# EAGLE design controller12lcd (EAGLE 8.3.1)

## Sheet 1 of 2
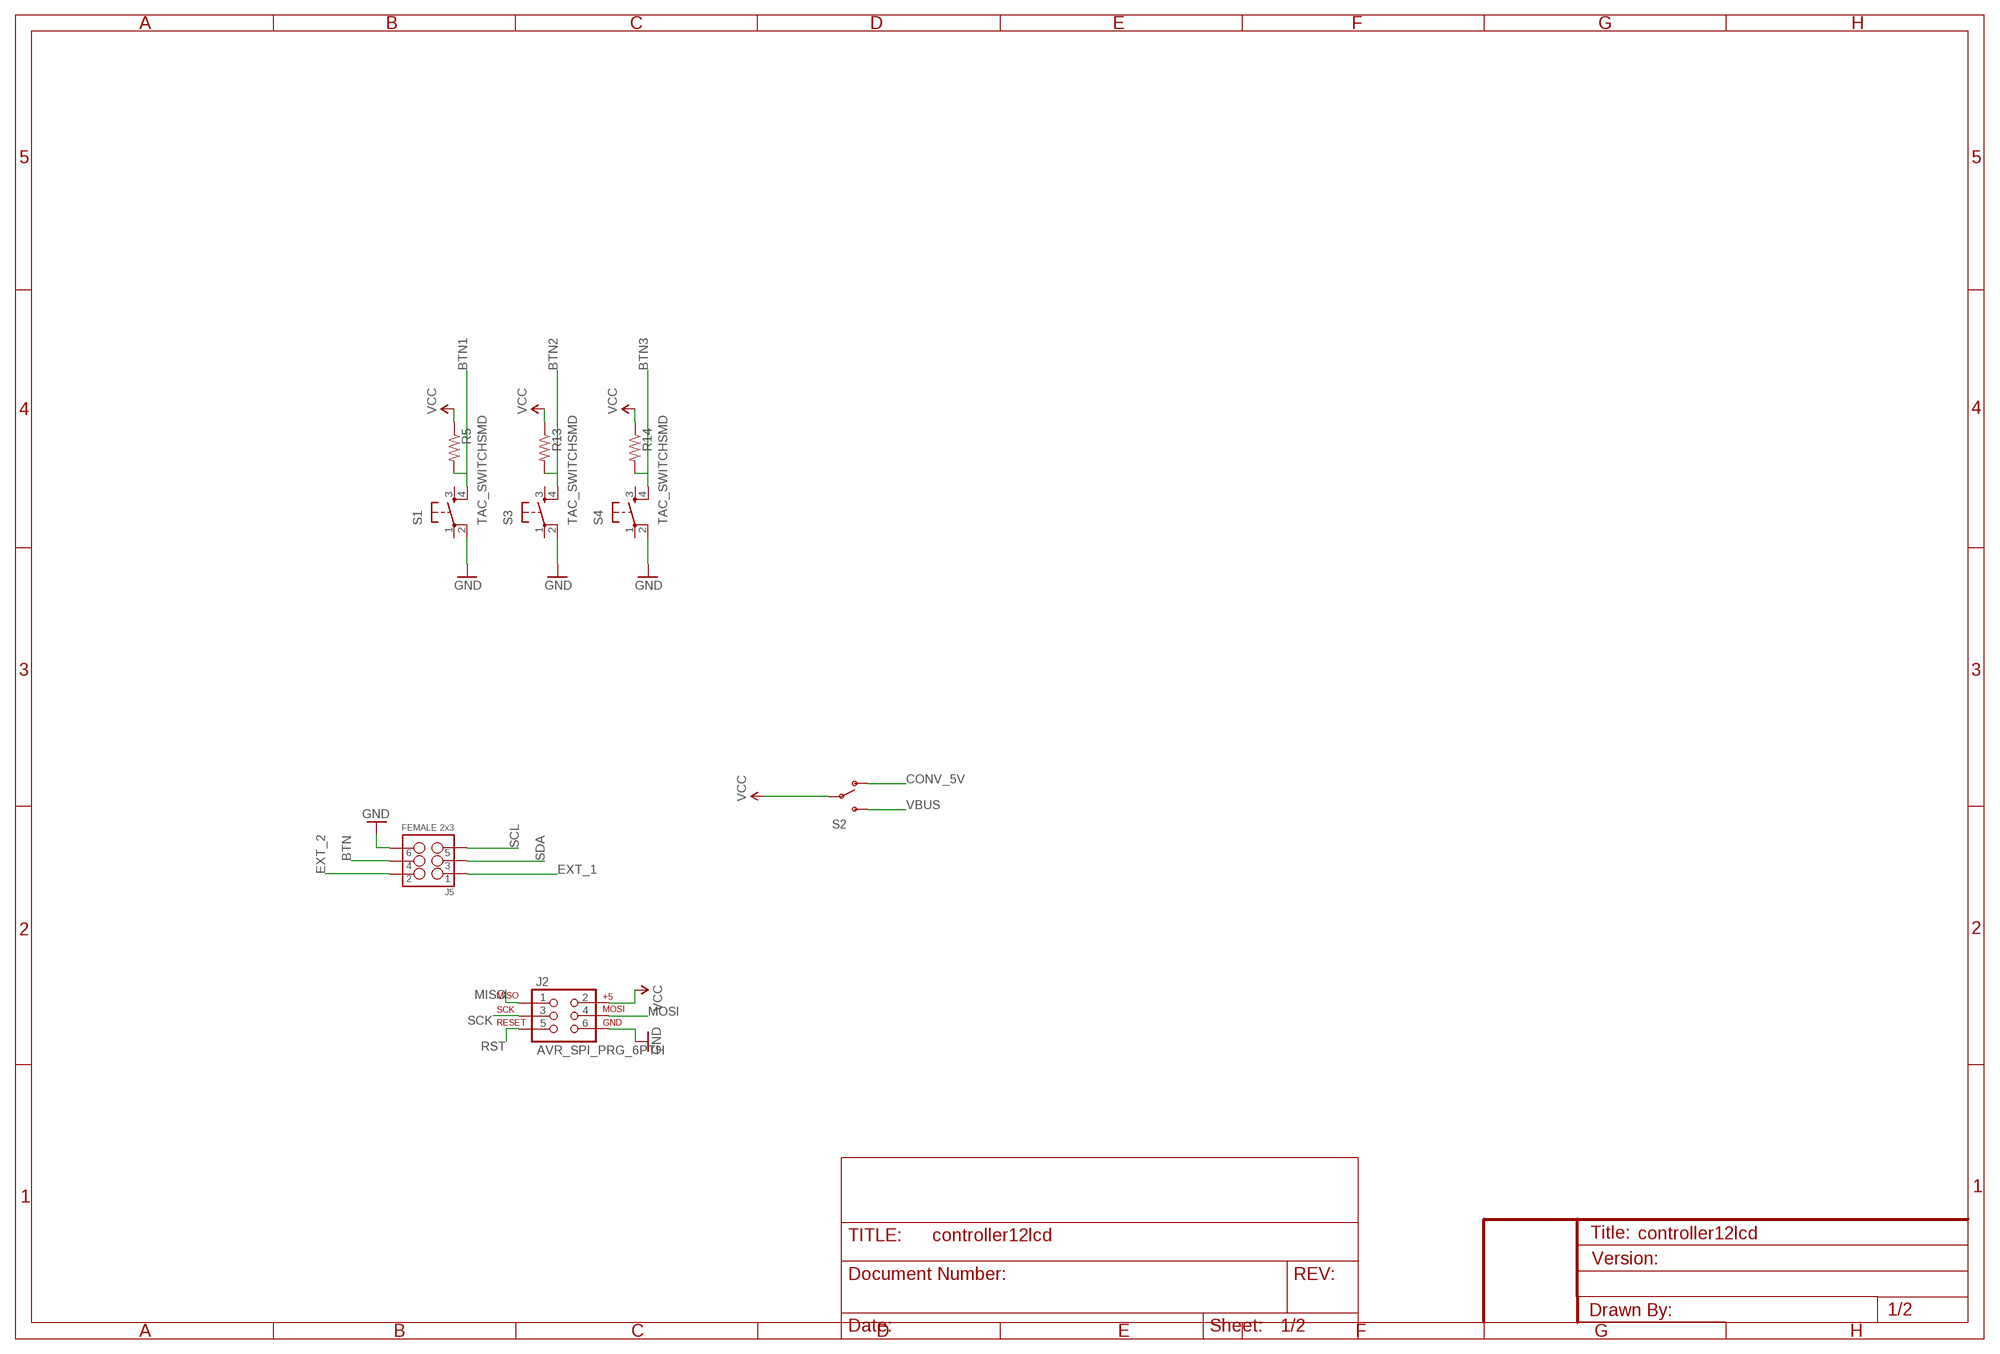
[diagram p0: schematic, sheet 1]

### Parts
J2  AVR_SPI_PRG_6PTH  [2X3]
J5  FEMALE 2x3  M03X2FEMALE  [2X3]
R5  RESISTOR1206  [1206]
R13  RESISTOR1206  [1206]
R14  RESISTOR1206  [1206]
S1  TAC_SWITCHSMD  TAC_SWITCHPTH  [TACTILE-PTH]
S2  SWITCH-SPDTSMD2  [SWITCH-SPDT-SMD]
S3  TAC_SWITCHSMD  TAC_SWITCHPTH  [TACTILE-PTH]
S4  TAC_SWITCHSMD  TAC_SWITCHPTH  [TACTILE-PTH]

### Nets
BTN: J5.4
BTN1: R5.2 S1.4
BTN2: R13.2 S3.4
BTN3: R14.2 S4.4
CONV_5V [power]: S2.1(O)
EXT_1: J5.1
EXT_2: J5.2
GND: J2.6 J5.6 S1.2 S3.2 S4.2 ; also sheet 2
MISO: J2.1
MOSI: J2.4
RST: J2.5
SCK: J2.3
SCL: J5.5
SDA: J5.3
VBUS: S2.3(S)
VCC [power]: J2.2 R5.1 R13.1 R14.1 S2.2(P) ; also sheet 2
Unconnected: S1.1 S1.3 S3.1 S3.3 S4.1 S4.3

## Sheet 2 of 2
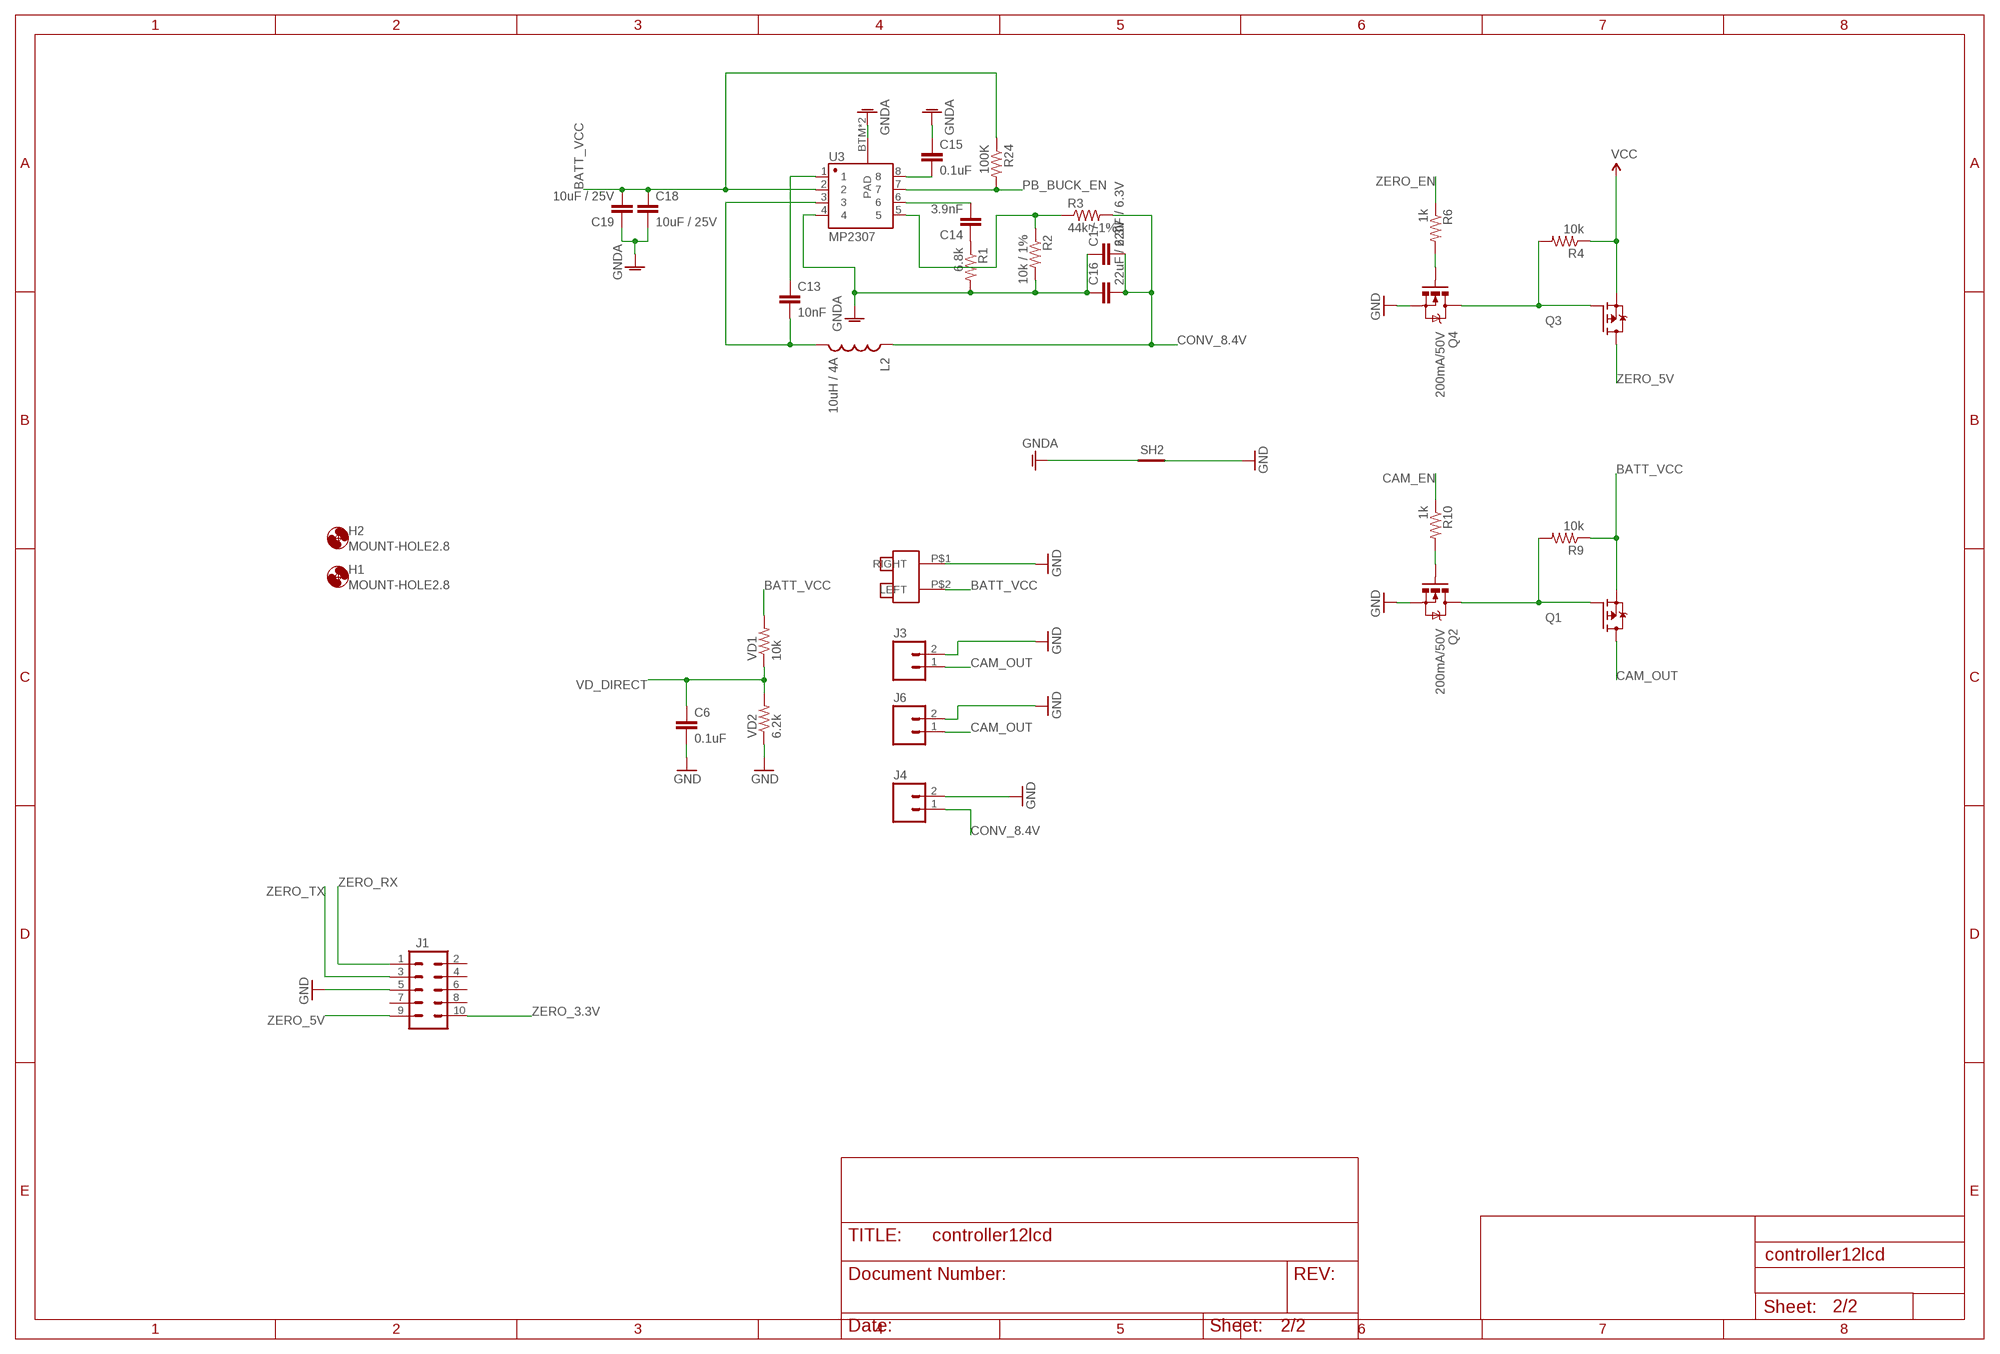
[diagram p1: schematic, sheet 2]

### Parts
C6  0.1uF  CAP1206  [1206]
C13  10nF  CAP1206  [1206]
C14  3.9nF  CAP1206  [1206]
C15  0.1uF  CAP1206  [1206]
C16  22uF / 6.3V  CAP1210  [1210]
C17  22uF / 6.3V  CAP1210  [1210]
C18  10uF / 25V  CAP1210  [1210]
C19  10uF / 25V  CAP1210  [1210]
H1  MOUNT-HOLE2.8  [2,8]
H2  MOUNT-HOLE2.8  [2,8]
J1  M05X2PTH  [AVR_ICSP]
J3  M023.5MM_LOCK  [SCREWTERMINAL-3.5MM-2_LOCK]
J4  M02PTH  [1X02]
J6  M023.5MM_LOCK  [SCREWTERMINAL-3.5MM-2_LOCK]
L2  10uH / 4A  INDUCTORSRU1038  [SRU1038]
Q1  FDD4141TO252  [TO252]
Q2  200mA/50V  MOSFET-NCHANNELBSS138  [SOT23-3]
Q3  FDD4141TO252  [TO252]
Q4  200mA/50V  MOSFET-NCHANNELBSS138  [SOT23-3]
R1  6.8k  RESISTOR1206  [1206]
R2  10k / 1%  RESISTOR1206  [1206]
R3  44k / 1%  RESISTOR1206  [1206]
R4  10k  RESISTOR1206  [1206]
R6  1k  RESISTOR1206  [1206]
R9  10k  RESISTOR1206  [1206]
R10  1k  RESISTOR1206  [1206]
R24  100K  RESISTOR1206  [1206]
SH2  SHORT-HT5  [SHORT_TOP-50]
U3  MP2307  GENERIC-SOIC8MSGEQ7N-FILTER  [SO08]
U$4  NANOFIT2  [NANOFIT2]
VD1  10k  RESISTOR1206  [1206]
VD2  6.2k  RESISTOR1206  [1206]

### Nets
BATT_VCC [camera_power]: C18.1 C19.2 Q1.2(S) R9.1 R24.1 U3.2 U$4.P$2(LEFT) VD1.2
CAM_EN: R10.1
CAM_OUT [camera_power]: J3.1 J6.1 Q1.3(D)
CONV_8.4V [power]: C16.2 C17.2 J4.1 L2.1 R3.2
GND: C6.2 J1.5 J3.2 J4.2 J6.2 Q2.2(S) Q4.2(S) SH2.2 U$4.P$1(RIGHT) VD2.1 ; also sheet 1
GNDA [power]: C15.1 C16.1 C17.1 C18.2 C19.1 R1.2 R2.2 SH2.1 U3.4 U3.BTM(PAD) U3.P$1(PAD)
N$1: Q1.1(G) Q2.3(D) R9.2
N$2: Q4.1(G) R6.2
N$3: Q3.1(G) Q4.3(D) R4.2
N$6: Q2.1(G) R10.2
N$25: C15.2 U3.8
N$26 [power]: C13.2 L2.2 U3.3
N$27: C13.1 U3.1
N$28: C14.1 R1.1
N$29: C14.2 U3.6
N$30: R2.1 R3.1 U3.5
PB_BUCK_EN: R24.2 U3.7
VCC [power]: Q3.2(S) R4.1 ; also sheet 1
VD_DIRECT: C6.1 VD1.1 VD2.2
ZERO_3.3V: J1.10
ZERO_5V [power]: J1.9 Q3.3(D)
ZERO_EN: R6.1
ZERO_RX: J1.1
ZERO_TX: J1.3
Unconnected: J1.2 J1.4 J1.6 J1.7 J1.8

## Library data of the parts
C6 C13-C19 = SparkFun-Capacitors:CAP: Capacitor Standard 0603 ceramic capacitor, and 0.1" leaded capacitor.
H1 H2 = holes:MOUNT-HOLE: MOUNTING HOLE with drill center marker
J1 = SparkFun-Connectors:M05X2: Header 5x2 Standard 10-pin dual row 0.1" header. Commonly used with AVR-ISP. Use with Spark Fun Electronics SKU: PRT-00778
J2 = SparkFun-Connectors:AVR_SPI_PRG_6: AVR ISP 6 Pin This is the reduced ISP connector for AVR programming. Common on Arduino. This footprint will take up less PCB space and can be used with a 10-pin to 6-pin adapter such as SKU: BOB-08508 **Special note about "TEST_POINT" package. The stop mask is on the top side, so if you want your programming test points to be on the bottom of your board, make sure to place this package on the bottom side of the board. This also ensure that the orientation to program from the bottom side will be correct.
J3 J6 = SparkFun-Connectors:M02: Standard 2-pin 0.1" header. Use with - straight break away headers ( PRT-00116) - right angle break away headers (PRT-00553) - swiss pins (PRT-00743) - machine pins (PRT-00117) - female headers (PRT-00115) Molex polarized connector foot print use with: PRT-08233 with associated crimp pins and housings. 2.54_SCREWTERM for use with PRT-10571. 3.5mm Screw Terminal footprints for PRT-08084 5mm Screw Terminal footprints for use with PRT-08432; PROD_ID: CONN-08399
J4 = SparkFun-Connectors:M02: Standard 2-pin 0.1" header. Use with - straight break away headers ( PRT-00116) - right angle break away headers (PRT-00553) - swiss pins (PRT-00743) - machine pins (PRT-00117) - female headers (PRT-00115) Molex polarized connector foot print use with: PRT-08233 with associated crimp pins and housings. 2.54_SCREWTERM for use with PRT-10571. 3.5mm Screw Terminal footprints for PRT-08084 5mm Screw Terminal footprints for use with PRT-08432
J5 = SparkFun-Connectors:M03X2: 2x3 .1" header. Shrouded, with keying- CONN-10681 SMT- CONN-11415 Pogo pins- HW-11044; PROD_ID: CONN-11566
L2 = SparkFun-Passives:INDUCTOR: Inductors Basic Inductor/Choke - 0603 and 1206. Footprints are not proven and vary greatly between part numbers. INDUCTOR POWER 3.3UH 4.0A SMD 0.197" L x 0.197" W x 0.177" H (5.00mm x 5.00mm x 4.50mm)
Q1 Q3 = transistor-fet:FDD4141: P-Channel PowerTrench® MOSFET Source: FDD4141.pdf
Q2 Q4 = SparkFun-DiscreteSemi:MOSFET-NCHANNEL: Common NMOSFET Parts MFG P/N Store ID Prod ID FDD8780 TRANS-09984 SI7820DN TRANS-11055 FDS6630A IC-08089 2N7002PW TRANS-11151 FQP30N06L COM-10213 TRANS-10060 BSS123LT1G TRANS-08345 BSS138 TRANS-00830 BS170 2N7000; PROD_ID: TRANS-00830
R1-R4 R6 R9 R10 R24 = SparkFun-Resistors:RESISTOR: Resistor Basic schematic elements and footprints for 0603, 1206, and PTH resistors.
R5 R13 R14 VD1 VD2 = SparkFun-Passives:RESISTOR: Resistor Basic schematic elements and footprints for 0603, 1206, and PTH resistors.
S1 S3 S4 = SparkFun-Retired:TAC_SWITCH: Momentary Switch Button commonly used for reset or general input. Spark Fun Electronics SKU : COM-00097 SMT- SWCH-08247
S2 = SparkFun-Electromechanical:SWITCH-SPDT: SPDT Switch Simple slide switch, Spark Fun Electronics SKU : COM-00102 DPDT SMT slide switch, AYZ0202, SWCH-08179
SH2 = shorts:SHORT-H: Short between two nets; BOM: no
U3 = SparkFun-AnalogIC:GENERIC-SOIC8: A placeholder for generic narrow & wide SOIC8 foorptints - used on the DIP adapter board.; PROD_ID: IC-10141
U$4 = volzolib:NANOFIT2

## Net classes
0 default: width 0.254 mm, clearance 0.254 mm
1 power: width 0.381 mm, clearance 0.254 mm
2 camera_power: width 0.66 mm, clearance 0.254 mm
3 usbsignal: width 0.254 mm, clearance 0.203 mm

## Board
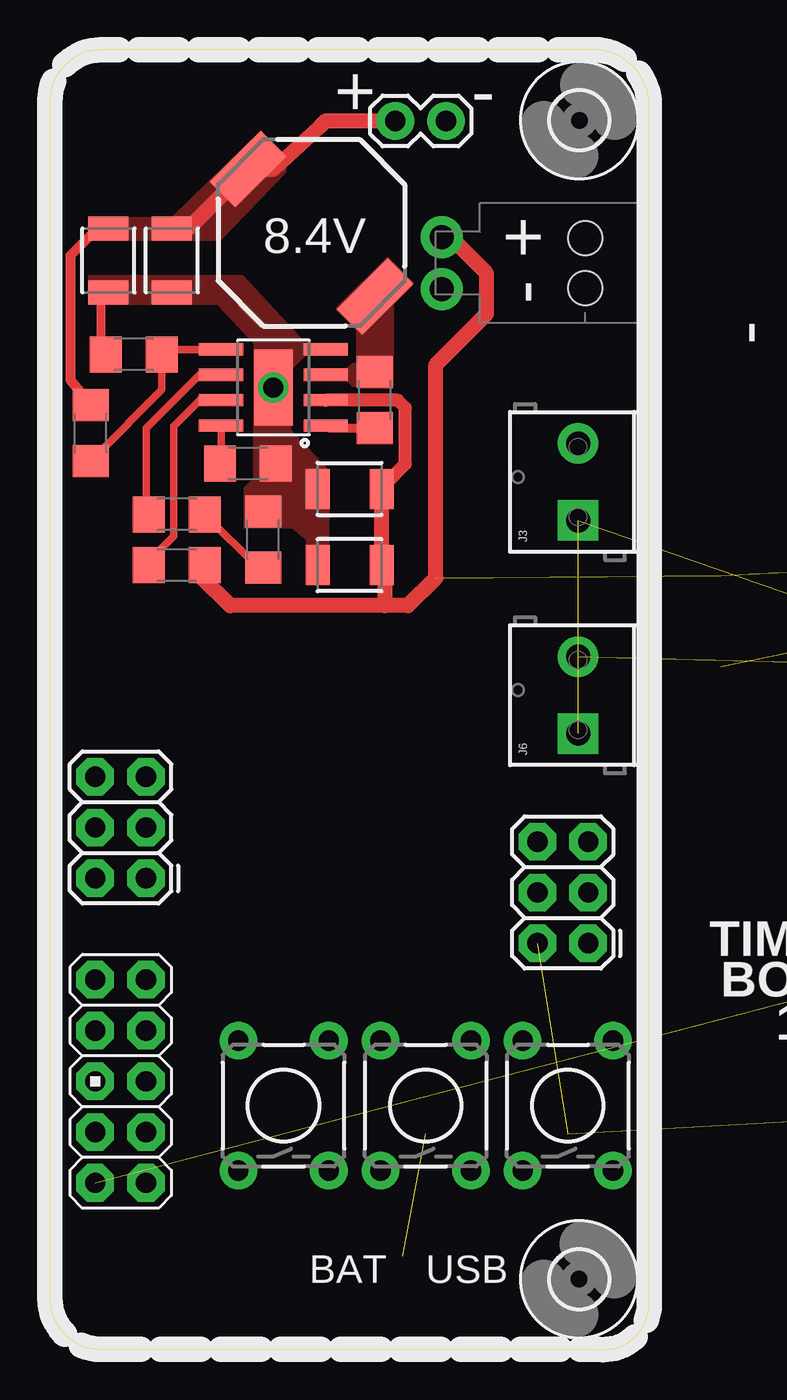
[diagram p2: board, top side]
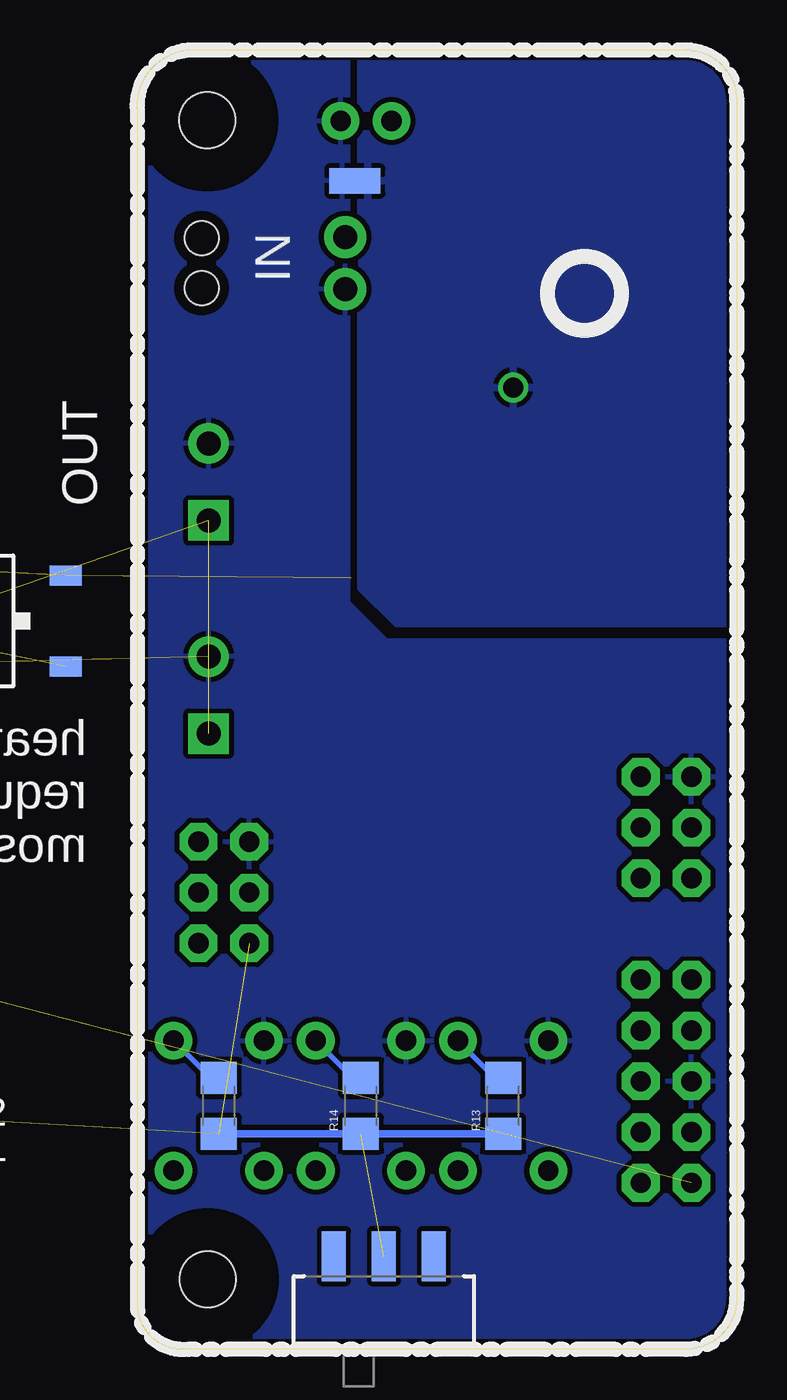
[diagram p3: board, bottom side, seen from below]

Size 29.98 x 65.04 mm. Coordinates in mm from the lower left corner, seen from the top.
Outline: 0,2.55 arc90 2.54,0.01 27.43,0.01 arc90 29.97,2.05 29.97,61.99 arc90 27.43,65.04 2.54,65.04 arc90 0,62.5 0,2.55
Copper layers (1*16): Top 0.035mm / dielectric 1.5mm / Bottom 0.035mm
Design rules "default *": minimum track width 10mil, minimum drill 24mil, track to track 8mil, track to pad 8mil, pad to pad 8mil, via to via 8mil, smd to smd 8mil, copper to edge 20mil, drill to drill 8mil, minimum pad ring 10mil, minimum via ring 8mil, stop-mask expansion 4mil, vias tented up to drill 0mil, thermal gap 10mil

### Footprints (pad centres in the part's own frame; a part is rotated, then mirrored left to right if it is on the bottom)
1206 = smd 1.6 x 1.8: 1 -1.4,0; 2 1.4,0
1210 = smd 1.2 x 2: 1 -1.6,0; 2 1.6,0
2,8 = hole 2.8: 0,0
AVR_ICSP = drill 1.016 pad 1.88 octagon: 1 -1.27,5.08; 2 1.27,5.08; 3 -1.27,2.54; 4 1.27,2.54; 5 -1.27,0; 6 1.27,0; 7 -1.27,-2.54; 8 1.27,-2.54; 9 -1.27,-5.08; 10 1.27,-5.08
2X3 = drill 1.016 pad 1.88 octagon: 1 0,0; 2 0,2.54; 3 2.54,0; 4 2.54,2.54; 5 5.08,0; 6 5.08,2.54
SCREWTERMINAL-3.5MM-2_LOCK = drill 1.2 pad 2.032 square: 1 -0.178,0 | drill 1.2 pad 2.032: 2 3.678,0
1X02 = drill 1.016 pad 1.88: 1 0,0; 2 2.54,0
SRU1038 = smd 1.8 x 3.6: 1 -4.5,0; 2 4.5,0
TO252 = smd 1 x 1.6: 1 -2.28,-4.8; 2 2.28,-4.8 | smd 5.4 x 6.2: 3 0,2.5
SOT23-3 = smd 0.8 x 0.9: 1 -0.95,-1; 2 0.95,-1; 3 0,1.1
TACTILE-PTH = drill 1.016 pad 1.88: 1 -3.251,2.261; 2 3.251,2.261; 3 -3.251,-2.261; 4 3.251,-2.261
SWITCH-SPDT-SMD = smd 1.2 x 2.5: 1 -2.5,-2.75; 2 0,-2.75; 3 2.5,-2.75
SHORT_TOP-50 = smd 1.27 x 1.27: 1 0.635,0; 2 -0.635,0
SO08 = smd 0.61 x 2.21: 1 -1.905,-2.616; 2 -0.635,-2.616; 3 0.635,-2.616; 4 1.905,-2.616; 5 1.905,2.616; 6 0.635,2.616; 7 -0.635,2.616; 8 -1.905,2.616 | smd 3.81 x 1.93: BTM 0,0 | drill 1: P$1 0,0
NANOFIT2 = drill 1.2 pad 2.1: P$1 10.38,1.3; P$2 10.38,-1.3 | hole 1.7: 3.2,1.25; 3.2,-1.25

### Placement (x,y rotation side)
C6  52.2,34.05 0 bottom  (outside the outline)
C13  16.26,47.51 90 top
C14  6.35,41.8 180 top
C15  9.91,44.34 180 top
C16  2.92,54.5 90 top
C17  6.1,54.5 90 top
C18  14.99,39.26 180 top
C19  14.99,43.07 0 top
H1  26.47,3.52 0 top
H2  26.48,61.52 0 top
J1  3.53,13.42 0 top
J2  26.92,20.33 90 top
J3  26.42,41.67 90 top
J4  17.27,61.48 0 top
J5  4.8,23.58 90 top
J6  26.42,31 90 top
L2  13.08,55.89 315 top
Q1  38.35,36.46 90 bottom  (outside the outline)
Q2  54.99,48.15 270 top  (outside the outline)
Q3  53.98,21.22 270 bottom  (outside the outline)
Q4  58.29,14.36 180 top  (outside the outline)
R1  10.67,40.53 90 top
R2  4.19,49.8 180 top
R3  2.03,45.86 90 top
R4  48.77,10.68 270 top  (outside the outline)
R5  25.91,12.21 90 bottom
R6  50.8,14.75 180 top  (outside the outline)
R9  59.44,40.91 270 bottom  (outside the outline)
R10  60.07,47.38 90 top  (outside the outline)
R13  11.68,12.21 90 bottom
R14  18.8,12.21 90 bottom
R24  6.35,39.26 180 top
S1  25.91,12.21 90 top
S2  17.65,1.92 180 bottom
S3  11.68,12.21 90 top
S4  18.8,12.21 90 top
SH2  19.1,58.48 0 bottom
U3  11.18,48.15 90 top
U$4  29.97,54.37 180 top
VD1  52.2,39.64 0 bottom  (outside the outline)
VD2  52.2,36.84 180 bottom  (outside the outline)

### Tracks (layer width: path | path; a pad name or v marks a point on that pad's centre or on a via)
BATT_VCC  (3 unrouted)
  Top 0.66: 16.51,43.07 C19.2 16.76,43.32 17.78,44.34 17.78,47.13 17.4,47.51 U3.2 | 16.51,39.26 C18.1
  Top 0.762: 16.59,39.33 C19.2 | 16.59,39.33 16.51,39.26 | C18.1 16.39,39.26 | 16.51,38.75 16.59,38.82 16.59,39.33 | 16.76,37.22 17.91,37.22 19.3,38.62 19.3,49.29 21.84,51.83 21.84,53.86 20.32,55.39 19.88,55.39 U$4.P$2 | 16.76,37.22 9.02,37.22 7.62,38.62 7.62,39.13 R24.1 | 16.76,37.22 16.76,39.15 16.59,39.33
BTN1
  Bottom 0.254: R5.2 26.32,13.61 S1.4
BTN2
  Bottom 0.254: R13.2 12.09,13.61 S3.4
BTN3
  Bottom 0.254: R14.2 19.2,13.61 S4.4
CAM_OUT  (2 unrouted)
CONV_8.4V
  Top 0.508: 2.29,56.4 2.62,56.4 C16.2 2.36,56.1 1.02,54.75 1.02,48.52 R3.2
  Top 0.762: 11.19,59.08 L2.1 6.92,56.1 C17.2 | 10.67,59.06 11.19,59.08 | 11.19,59.08 13.46,61.16 13.78,61.48 J4.1
  pour Top (no thermals): 1.91,55.51 8.51,55.51 11.81,58.94 11.81,59.7 10.54,60.97 6.1,56.66 2.16,56.66 2.03,56.27
GND  (4 unrouted)
  pour Bottom: 29.84,0.01 0,0.01 -0.13,35.45 17.53,35.45 19.43,37.35 19.43,65.04 29.84,65.04
GNDA
  Top 0.457: R2.2 2.54,50.69 2.54,52.46 C16.1
  pour Top (no thermals): 1.91,52.31 8.36,52.31 10.19,50.36 10.16,43.57 9.7,43.12 9.7,41.11 12.09,41.14 12.83,40.53 12.83,38.37 13.97,38.37 13.97,43.96 12.06,45.99 12.06,49.04 12.83,49.8 12.83,50.31 9.65,53.73 1.91,53.73
  pour Bottom: 18.8,38.11 18.8,56.91 18.8,60.47 18.8,65.42 -0.13,65.42 -0.13,36.34 17.02,36.34
N$1  (2 unrouted)
N$2  (1 unrouted)
N$3  (2 unrouted)
N$6  (1 unrouted)
N$25
  Top 0.381: U3.8 8.56,44.39 C15.2
N$26
  pour Top (no thermals): 12.83,48.53 14.86,48.53 15.11,48.27 17.14,48.27 17.14,52.34 18.16,53.35 16.89,54.62 14.35,52.08 15.37,51.07 15.37,49.29 15.11,49.29 14.86,49.04 12.83,49.04
N$27
  Top 0.254: 13.97,46.11 13.84,46.24 U3.1 | C13.1
  Top 0.457: 13.97,46.11 C13.1
N$28
  Top 0.381: R1.1 10.42,39.13 C14.1
N$29
  Top 0.381: U3.6 7.49,48.78 4.83,46.11 4.83,41.92 C14.2
N$30
  Top 0.381: U3.5 5.84,50.05 R2.1 5.59,48.03 3.94,46.38 3.94,46.37 R3.1
PB_BUCK_EN
  Top 0.381: R24.2 4.95,39.47 6.19,40.71 6.19,46.21 7.62,47.64 8.43,47.64 U3.7
VCC  (4 unrouted)
  Bottom 0.381: R13.1 R14.1 R5.1
VD_DIRECT  (2 unrouted)
ZERO_5V  (1 unrouted)

### Text on the board
tPlace: + | - | 8.4V | + | - | + | - | TIME | BOX | 12 | BAT | USB
bPlace: IN | OUT | heat/fan / requires N-CHANNEL / mosfets | VD2 | VD1